# Altium schematic sheet jarit'_paneli.SchDoc
size A3; Organization: Yandex; Address2: 11 Timura Frunze st., building 2; Release_Date: yyyy-mm-dd; Language: en; Organization2: Self Driving Group LLC
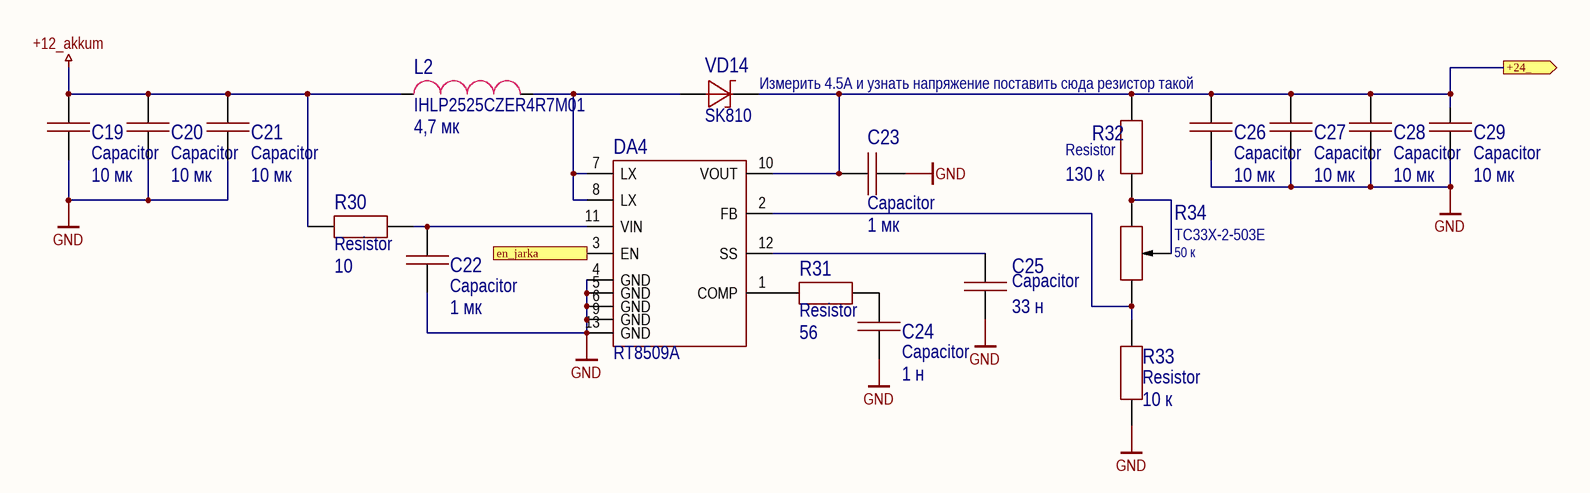
[diagram p0: jarit'_paneli.SchDoc]

## Parts
C19  Capacitor  value 10 мк  [1210C]
C20  Capacitor  value 10 мк  [1210C]
C21  Capacitor  value 10 мк  [1210C]
C22  Capacitor  value 1 мк  [0603C]
C23  Capacitor  value 1 мк  [0603C]
C24  Capacitor  value 1 н  [0603C]
C25  Capacitor  value 33 н  [0603C]
C26  Capacitor  value 10 мк  [1210C]
C27  Capacitor  value 10 мк  [1210C]
C28  Capacitor  value 10 мк  [1210C]
C29  Capacitor  value 10 мк  [1210C]
DA4  RT8509A  [WDFN5x5-12]
L2  IHLP2525CZER4R7M01  value 4,7 мк  [IHLP-2525]
R30  Resistor  value 10  [0603R]
R31  Resistor  value 56  [0603R]
R32  Resistor  value 130 к  [0603R]
R33  Resistor  value 10 к  [0603R]
R34  TC33X-2-503E  value 50 к  [3mm_trim]
VD14  SK810  [SMC]

## Ports
+24_ (out), en_jarka (in)

## Nets
+12_akkum: C19.2 C20.2 C21.2 L2.1 R30.2
GND: C19.1 C20.1 C21.1 C22.1 C23.2 C24.1 C25.2 C26.1 C27.1 C28.1 C29.1 DA4.4(GND) DA4.5(GND) DA4.6(GND) DA4.9(GND) DA4.13(GND) R33.2
+24_: C23.1 C26.2 C27.2 C28.2 C29.2 DA4.10(VOUT) R32.2 VD14.2 ; port +24_
en_jarka: DA4.3(EN) ; port en_jarka
NetC22_2: C22.2 DA4.11(VIN) R30.1
NetC24_2: C24.2 R31.2
NetC25_1: C25.1 DA4.12(SS)
NetDA4_1: DA4.1(COMP) R31.1
NetDA4_2: DA4.2(FB) R33.1 R34.3
NetDA4_7: DA4.7(LX) DA4.8(LX) L2.2 VD14.1
NetR32_1: R32.1 R34.1 R34.2

## Notes on the sheet
- Измерить 4.5А и узнать напряжение поставить сюда резистор такой
- 1
- 2
- 3
- 4
- 5
- 6
- 7
- 8
- A
- B
- C
- D
- E
- Responsible department
- Technical reference
- Document type
- Document status
- F
- Legal owner
- Created by
- Schematic drawing
- Title, Supplementary title
- CONFIDENTIAL
- Yandex
- Commercial secret
- Self Driving Group LLC
- Approved by
- Doc Rev.
- Date of Issue
- Lang.
- Sheet
- A3

## Library data of the parts
C19-C21 C26-C29 = Capacitor_10u_10_35V_X7R_1210C: Конденсатор; Tolerance: 0,1; Voltage (V): 35; Dielectric: X7R; Capacity (nF): 10000; Part Number: Capacitor_10u_10_35V_X7R_1210C
C22 C23 = Capacitor_1u_10_50V_X7R_0603C: Конденсатор; Tolerance: 0,1; Voltage (V): 50; Dielectric: X7R; Capacity (nF): 1000; Part Number: Capacitor_1u_10_50V_X7R_0603C
C24 = Capacitor_1n_10_50V_X7R_0603C: Конденсатор; Tolerance: 0,1; Voltage (V): 50; Dielectric: X7R; Capacity (nF): 1; Part Number: Capacitor_1n_10_50V_X7R_0603C
C25 = Capacitor_33n_10_50V_X7R_0603C: Конденсатор; Tolerance: 0,1; Voltage (V): 50; Dielectric: X7R; Capacity (nF): 33; Part Number: Capacitor_33n_10_50V_X7R_0603C
DA4 = RT8509A: Импульсный повышающий DC-DC стабилизатор, регулируемый, 2.8В-14В (Vin), 24В/4.5A, 1.5МГц, WDFN-12; Part Number: RT8509A
L2 = IHLP2525CZER4R7M01: ЧИП-индуктивность экранированная 4,7мкГн ±20% 5,5A 40мОм 2525; Inductance (μH): 4,7; Current (A): 5,5; Part Number: IHLP2525CZER4R7M01
R30 = Resistor_10_1_0603: Резистор номиналом 10 Ом и точностью 1%; Power: *; Part Number: Resistor_10_1_0603; Tolerance: 1%
R31 = Resistor_56_1_0603: Резистор номиналом 56 Ом и точностью 1%; Power: *; Part Number: Resistor_56_1_0603; Tolerance: 1%
R32 = Resistor_130k_1_0603: Резистор номиналом 130 кОм и точностью 1%; Power: *; Part Number: Resistor_130k_1_0603; Tolerance: 1%
R33 = Resistor_10k_1_0603: Резистор номиналом 10 кОм и точностью 1%; Power: *; Part Number: Resistor_10k_1_0603; Tolerance: 1%
R34 = TC33X-2-503E: Потенциометр однооборотный керметный 50кОм 0.1Вт ±25% SMD лента на катушке; Tolerance: 50%; Part Number: TC33X-2-503E
VD14 = SK810: Диод шоттки на 100 В, ном. ток 8 А; Voltage nominal (V): 100; Current (A): 8; Part Number: SK810